# Altium schematic sheet 15_BTB_Connector_P101-P200.SchDoc: Board to Board Connector B
size 420 x 297 mm; Author: Lukas Henkel; DocumentNumber: 15; SheetNumber: 15; SheetTotal: 16; DocSize: A3
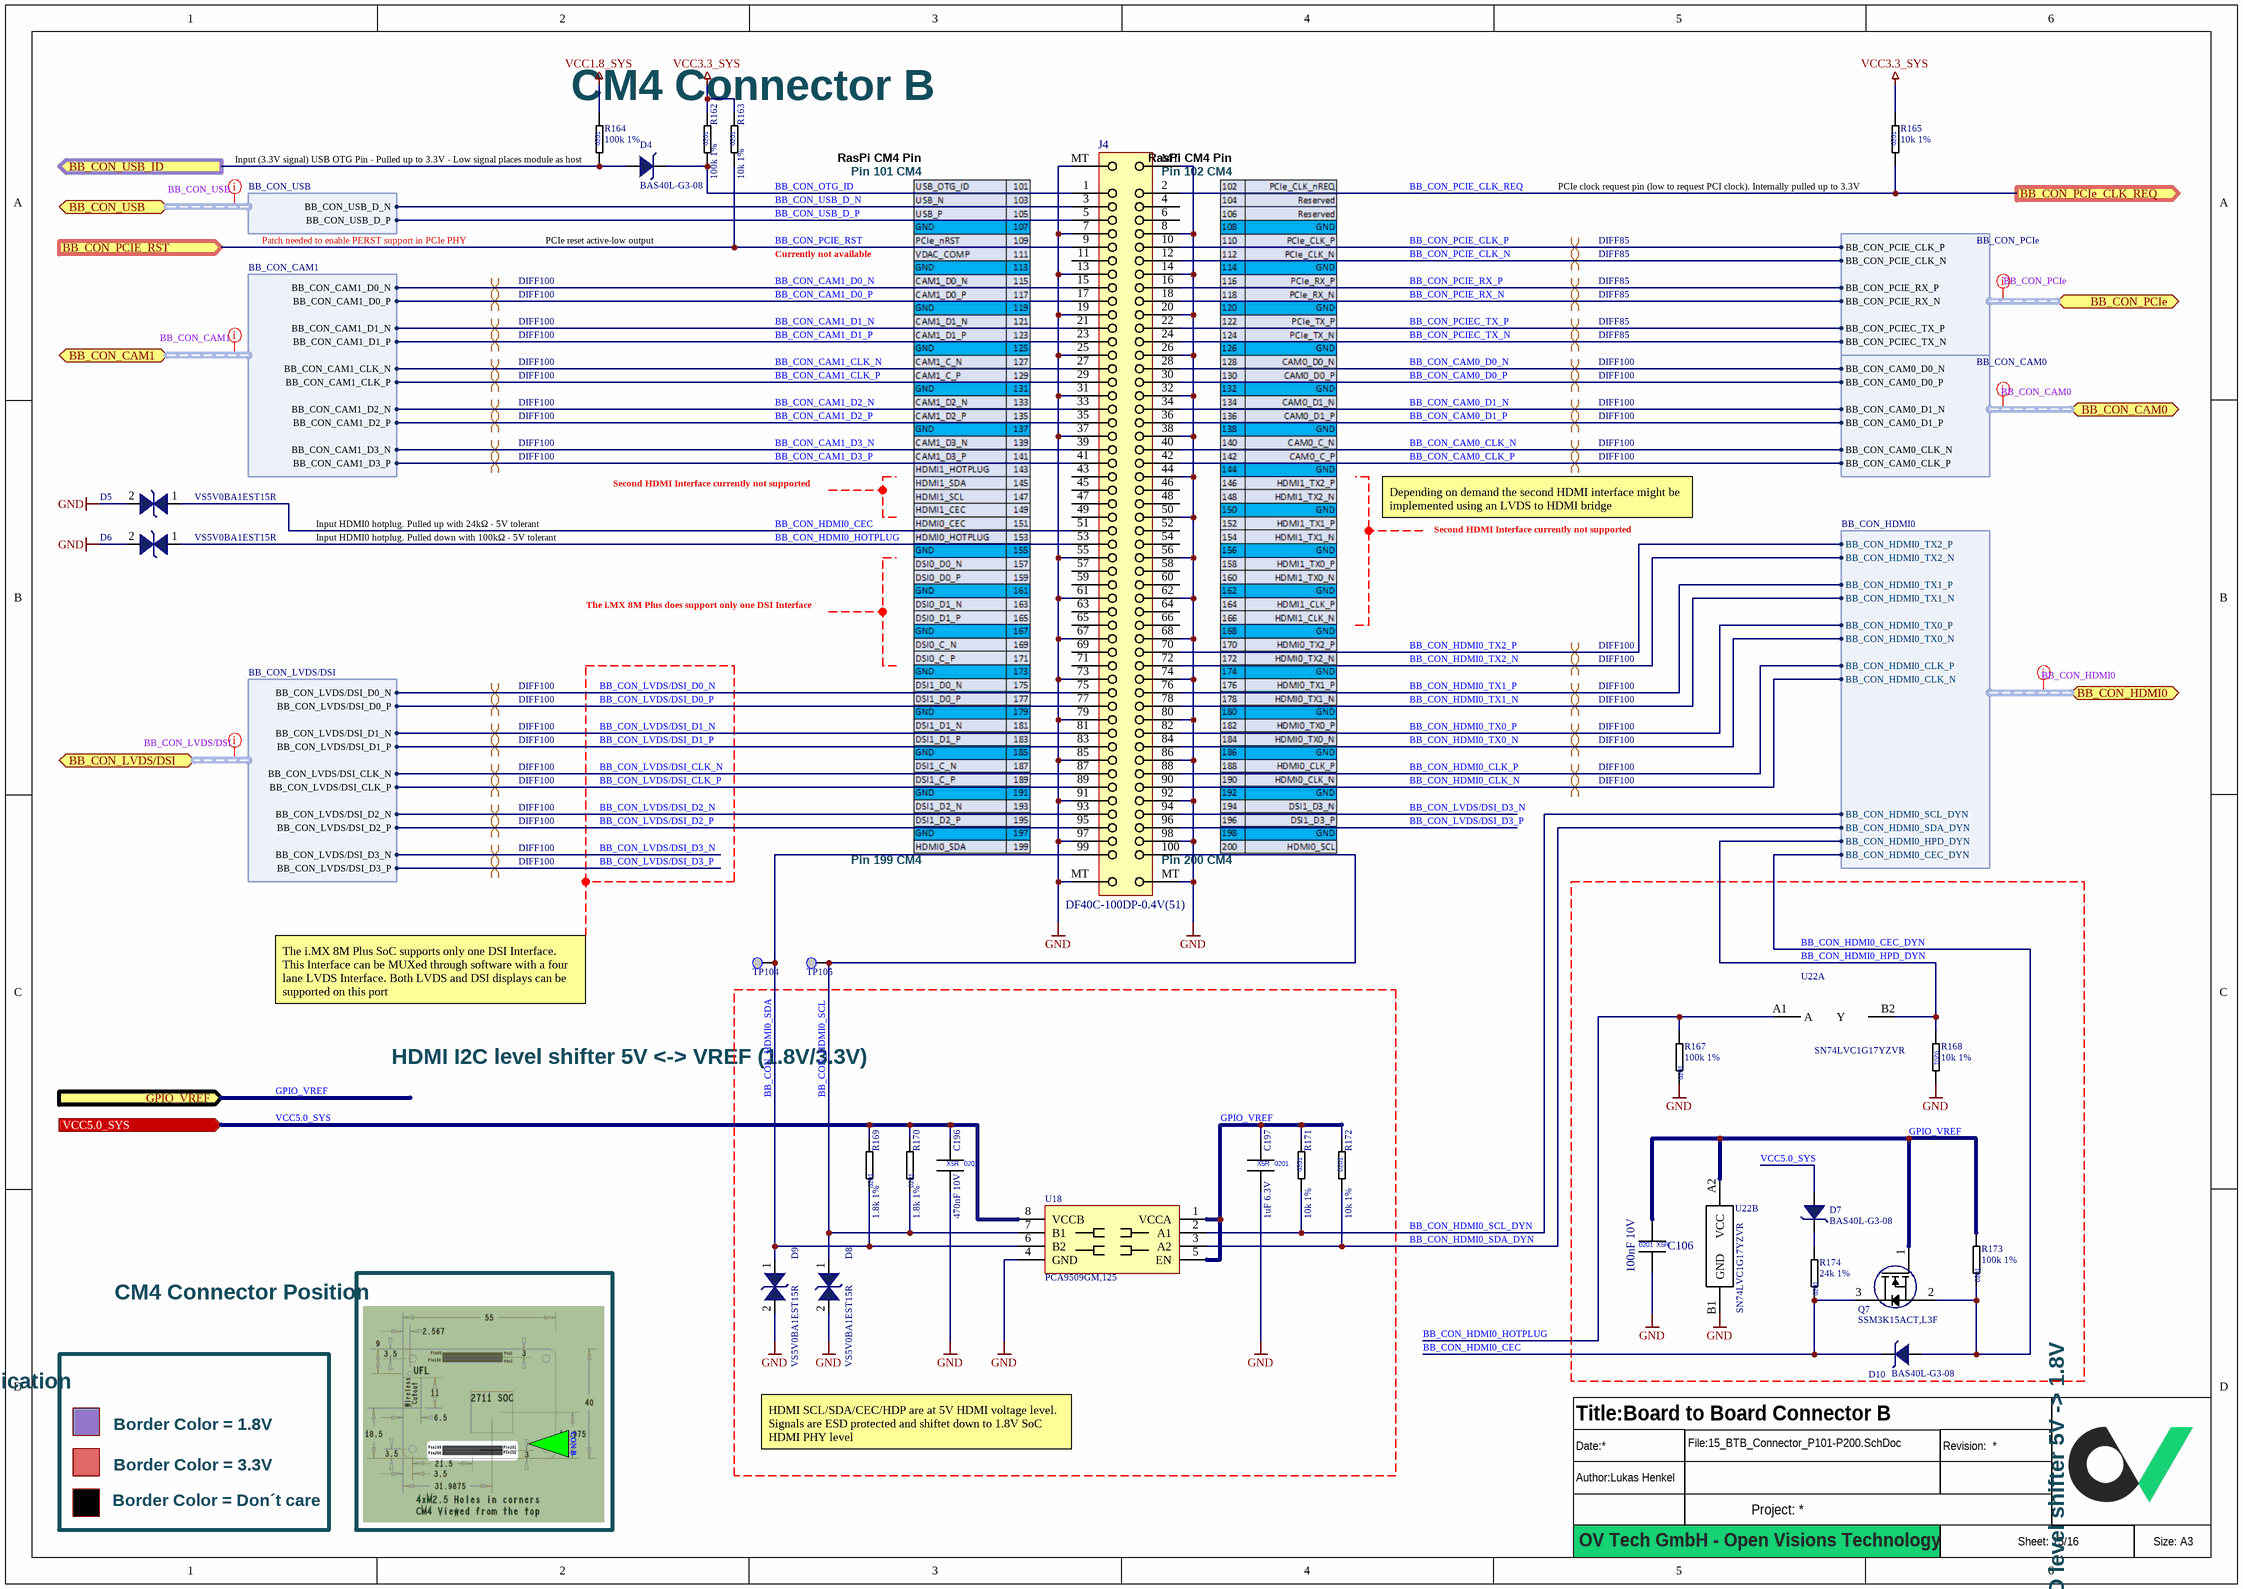
[diagram p0: 15_BTB_Connector_P101-P200.SchDoc]

## Parts
?  (no value)  (graphical)
C106  100nF 10V  [CAPC0603X03L]
C196  470nF 10V  [CAPC0603X03L]
C197  1uF 6.3V  [CAPC0603X03L]
D4  BAS40L-G3-08  [DFN1006-2A]
D5  VS5V0BA1EST15R  [DFN38P60X29-2L]
D6  VS5V0BA1EST15R  [DFN38P60X29-2L]
D7  BAS40L-G3-08  [DFN1006-2A]
D8  VS5V0BA1EST15R  [DFN38P60X29-2L]
D9  VS5V0BA1EST15R  [DFN38P60X29-2L]
D10  BAS40L-G3-08  [DFN1006-2A]
J4  DF40C-100DP-0.4V(51)  [BOARD-TO-BOARD DF40C-100DP-0.4V]
Q7  SSM3K15ACT,L3F  [DFN65P100X50-3L]
R162  100k 1%  [RESC0603X03L]
R163  10k 1%  [RESC0603X03L]
R164  100k 1%  [RESC0603X03L]
R165  10k 1%  [RESC0603X03L]
R167  100k 1%  [RESC0603X03L]
R168  10k 1%  [RESC0603X03L]
R169  1.8k 1%  [RESC0603X03L]
R170  1.8k 1%  [RESC0603X03L]
R171  10k 1%  [RESC0603X03L]
R172  10k 1%  [RESC0603X03L]
R173  100k 1%  [RESC0603X03L]
R174  24k 1%  [RESC0603X03L]
TP104  Testpoint 0.5mm  [TP_0.50mm]  (value not drawn)  (no BOM)
TP105  Testpoint 0.5mm  [TP_0.50mm]  (value not drawn)  (no BOM)
U18  PCA9509GM,125  [XQFN8_160X106X50]
U22  SN74LVC1G17YZVR  [BGA4C50P2X2_89X89X50]  (parts A,B of 2)

## Blocks framed on the sheet
HDMI CEC and HPD level shifter 5V -> 1.8V: C106 D7 D10 Q7 R167 R168 R173 R174 U22
HDMI I2C level shifter 5V <-> VREF (1.8V/3.3V): C196 C197 D8 D9 R169-R172 U18

## Ports
BB_CON_CAM0 (bidir, harness BB_CON_CAM0), BB_CON_CAM1 (bidir, harness BB_CON_CAM1), BB_CON_HDMI0 (bidir, harness BB_CON_HDMI0), BB_CON_LVDS/DSI (bidir, harness BB_CON_LVDS/DSI), BB_CON_PCIe (bidir, harness BB_CON_PCIe), BB_CON_PCIe_CLK_REQ (out), BB_CON_PCIE_RST (in), BB_CON_USB (bidir, harness BB_CON_USB), BB_CON_USB_ID (out), GPIO_VREF (in), VCC5.0_SYS (in)

## Harnesses
BB_CON_USB: BB_CON_USB_D_N, BB_CON_USB_D_P
BB_CON_PCIe: BB_CON_PCIE_CLK_N, BB_CON_PCIE_CLK_P, BB_CON_PCIEC_TX_N, BB_CON_PCIE_RX_P, BB_CON_PCIE_RX_N, BB_CON_PCIEC_TX_P
BB_CON_CAM1: BB_CON_CAM1_D0_N, BB_CON_CAM1_D0_P, BB_CON_CAM1_D1_N, BB_CON_CAM1_D1_P, BB_CON_CAM1_CLK_N, BB_CON_CAM1_CLK_P, BB_CON_CAM1_D2_N, BB_CON_CAM1_D2_P, BB_CON_CAM1_D3_N, BB_CON_CAM1_D3_P
BB_CON_CAM0: BB_CON_CAM0_D0_N, BB_CON_CAM0_D0_P, BB_CON_CAM0_D1_N, BB_CON_CAM0_D1_P, BB_CON_CAM0_CLK_N, BB_CON_CAM0_CLK_P
BB_CON_HDMI0: BB_CON_HDMI0_SCL_DYN, BB_CON_HDMI0_SDA_DYN, BB_CON_HDMI0_HPD_DYN, BB_CON_HDMI0_CEC_DYN, BB_CON_HDMI0_CLK_N, BB_CON_HDMI0_CLK_P, BB_CON_HDMI0_TX0_N, BB_CON_HDMI0_TX0_P, BB_CON_HDMI0_TX1_N, BB_CON_HDMI0_TX1_P, BB_CON_HDMI0_TX2_N, BB_CON_HDMI0_TX2_P
BB_CON_LVDS/DSI: BB_CON_LVDS/DSI_D0_P, BB_CON_LVDS/DSI_D0_N, BB_CON_LVDS/DSI_D1_P, BB_CON_LVDS/DSI_D1_N, BB_CON_LVDS/DSI_D2_P, BB_CON_LVDS/DSI_D2_N, BB_CON_LVDS/DSI_CLK_P, BB_CON_LVDS/DSI_CLK_N, BB_CON_LVDS/DSI_D3_P, BB_CON_LVDS/DSI_D3_N

## Nets
GND: C106.2 C196.2 C197.2 D5.2 D6.2 D8.2 D9.2 J4.7 J4.8 J4.13 J4.14 J4.19 J4.20 J4.25 J4.26 J4.31 J4.32 J4.37 J4.38 J4.44 J4.50 J4.55 J4.56 J4.61 J4.62 J4.67 J4.68 J4.73 J4.74 J4.79 J4.80 J4.85 J4.86 J4.91 J4.92 J4.97 J4.98 J4.MT R167.1 R168.2 U18.4(GND) U22.B1(GND)
VCC1.8_SYS: R164.2
VCC3.3_SYS: R162.2 R163.2 R165.2
BB_CON_CAM0_CLK_N: J4.40 ; port BB_CON_CAM0.BB_CON_CAM0_CLK_N
BB_CON_CAM0_CLK_P: J4.42 ; port BB_CON_CAM0.BB_CON_CAM0_CLK_P
BB_CON_CAM0_D0_N: J4.28 ; port BB_CON_CAM0.BB_CON_CAM0_D0_N
BB_CON_CAM0_D0_P: J4.30 ; port BB_CON_CAM0.BB_CON_CAM0_D0_P
BB_CON_CAM0_D1_N: J4.34 ; port BB_CON_CAM0.BB_CON_CAM0_D1_N
BB_CON_CAM0_D1_P: J4.36 ; port BB_CON_CAM0.BB_CON_CAM0_D1_P
BB_CON_CAM1_CLK_N: J4.27 ; port BB_CON_CAM1.BB_CON_CAM1_CLK_N
BB_CON_CAM1_CLK_P: J4.29 ; port BB_CON_CAM1.BB_CON_CAM1_CLK_P
BB_CON_CAM1_D0_N: J4.15 ; port BB_CON_CAM1.BB_CON_CAM1_D0_N
BB_CON_CAM1_D0_P: J4.17 ; port BB_CON_CAM1.BB_CON_CAM1_D0_P
BB_CON_CAM1_D1_N: J4.21 ; port BB_CON_CAM1.BB_CON_CAM1_D1_N
BB_CON_CAM1_D1_P: J4.23 ; port BB_CON_CAM1.BB_CON_CAM1_D1_P
BB_CON_CAM1_D2_N: J4.33 ; port BB_CON_CAM1.BB_CON_CAM1_D2_N
BB_CON_CAM1_D2_P: J4.35 ; port BB_CON_CAM1.BB_CON_CAM1_D2_P
BB_CON_CAM1_D3_N: J4.39 ; port BB_CON_CAM1.BB_CON_CAM1_D3_N
BB_CON_CAM1_D3_P: J4.41 ; port BB_CON_CAM1.BB_CON_CAM1_D3_P
BB_CON_HDMI0_CEC: D5.1 D10.1 J4.51 Q7.3(D) R174.1
BB_CON_HDMI0_CEC_DYN: D10.2 Q7.2(S) R173.1 ; port BB_CON_HDMI0.BB_CON_HDMI0_CEC_DYN
BB_CON_HDMI0_CLK_N: J4.90 ; port BB_CON_HDMI0.BB_CON_HDMI0_CLK_N
BB_CON_HDMI0_CLK_P: J4.88 ; port BB_CON_HDMI0.BB_CON_HDMI0_CLK_P
BB_CON_HDMI0_HOTPLUG: D6.1 J4.53 R167.2 U22.A1(A)
BB_CON_HDMI0_HPD_DYN: R168.1 U22.B2(Y) ; port BB_CON_HDMI0.BB_CON_HDMI0_HPD_DYN
BB_CON_HDMI0_SCL: D8.1 J4.100 R170.1 TP105.TP U18.7(B1)
BB_CON_HDMI0_SCL_DYN: R171.1 U18.2(A1) ; port BB_CON_HDMI0.BB_CON_HDMI0_SCL_DYN
BB_CON_HDMI0_SDA: D9.1 J4.99 R169.1 TP104.TP U18.6(B2)
BB_CON_HDMI0_SDA_DYN: R172.1 U18.3(A2) ; port BB_CON_HDMI0.BB_CON_HDMI0_SDA_DYN
BB_CON_HDMI0_TX0_N: J4.84 ; port BB_CON_HDMI0.BB_CON_HDMI0_TX0_N
BB_CON_HDMI0_TX0_P: J4.82 ; port BB_CON_HDMI0.BB_CON_HDMI0_TX0_P
BB_CON_HDMI0_TX1_N: J4.78 ; port BB_CON_HDMI0.BB_CON_HDMI0_TX1_N
BB_CON_HDMI0_TX1_P: J4.76 ; port BB_CON_HDMI0.BB_CON_HDMI0_TX1_P
BB_CON_HDMI0_TX2_N: J4.72 ; port BB_CON_HDMI0.BB_CON_HDMI0_TX2_N
BB_CON_HDMI0_TX2_P: J4.70 ; port BB_CON_HDMI0.BB_CON_HDMI0_TX2_P
BB_CON_LVDS/DSI_CLK_N: J4.87 ; port BB_CON_LVDS/DSI.BB_CON_LVDS/DSI_CLK_N
BB_CON_LVDS/DSI_CLK_P: J4.89 ; port BB_CON_LVDS/DSI.BB_CON_LVDS/DSI_CLK_P
BB_CON_LVDS/DSI_D0_N: J4.75 ; port BB_CON_LVDS/DSI.BB_CON_LVDS/DSI_D0_N
BB_CON_LVDS/DSI_D0_P: J4.77 ; port BB_CON_LVDS/DSI.BB_CON_LVDS/DSI_D0_P
BB_CON_LVDS/DSI_D1_N: J4.81 ; port BB_CON_LVDS/DSI.BB_CON_LVDS/DSI_D1_N
BB_CON_LVDS/DSI_D1_P: J4.83 ; port BB_CON_LVDS/DSI.BB_CON_LVDS/DSI_D1_P
BB_CON_LVDS/DSI_D2_N: J4.93 ; port BB_CON_LVDS/DSI.BB_CON_LVDS/DSI_D2_N
BB_CON_LVDS/DSI_D2_P: J4.95 ; port BB_CON_LVDS/DSI.BB_CON_LVDS/DSI_D2_P
BB_CON_LVDS/DSI_D3_N: J4.94 ; port BB_CON_LVDS/DSI.BB_CON_LVDS/DSI_D3_N
BB_CON_LVDS/DSI_D3_P: J4.96 ; port BB_CON_LVDS/DSI.BB_CON_LVDS/DSI_D3_P
BB_CON_OTG_ID: D4.1 J4.1 R162.1
BB_CON_PCIE_CLK_N: J4.12 ; port BB_CON_PCIe.BB_CON_PCIE_CLK_N
BB_CON_PCIE_CLK_P: J4.10 ; port BB_CON_PCIe.BB_CON_PCIE_CLK_P
BB_CON_PCIE_CLK_REQ: J4.2 R165.1 ; port BB_CON_PCIe_CLK_REQ
BB_CON_PCIE_RST: J4.9 R163.1 ; port BB_CON_PCIE_RST
BB_CON_PCIE_RX_N: J4.18 ; port BB_CON_PCIe.BB_CON_PCIE_RX_N
BB_CON_PCIE_RX_P: J4.16 ; port BB_CON_PCIe.BB_CON_PCIE_RX_P
BB_CON_PCIEC_TX_N: J4.24 ; port BB_CON_PCIe.BB_CON_PCIEC_TX_N
BB_CON_PCIEC_TX_P: J4.22 ; port BB_CON_PCIe.BB_CON_PCIEC_TX_P
BB_CON_USB_D_N: J4.3 ; port BB_CON_USB.BB_CON_USB_D_N
BB_CON_USB_D_P: J4.5 ; port BB_CON_USB.BB_CON_USB_D_P
BB_CON_USB_ID: D4.2 R164.1 ; port BB_CON_USB_ID
GPIO_VREF: C106.1 C197.1 Q7.1(G) R171.2 R172.2 R173.2 U18.1(VCCA) U18.5(EN) U22.A2(VCC) ; port GPIO_VREF
VCC5.0_SYS: C196.1 D7.2 R169.2 R170.2 U18.8(VCCB) ; port VCC5.0_SYS
NetD7_1: D7.1 R174.2

Not connected (* = marked no-connect by the designer): J4 4 6 11 43 45 46 47 48 49 52 54 57 58 59 60 63 64 65 66 69 71

## Layout directives
net class BB_CON_USB: (no net found under the mark)
net class BB_CON_PCIe: (no net found under the mark)
net class BB_CON_CAM1: (no net found under the mark)
net class BB_CON_CAM0: (no net found under the mark)
net class BB_CON_HDMI0: (no net found under the mark)
net class BB_CON_LVDS/DSI: (no net found under the mark)
differential pair; differential pair class DIFF85: BB_CON_PCIE_CLK_N, BB_CON_PCIE_CLK_P, BB_CON_PCIE_RX_N, BB_CON_PCIE_RX_P, BB_CON_PCIEC_TX_N, BB_CON_PCIEC_TX_P
differential pair; differential pair class DIFF100: BB_CON_CAM0_CLK_N, BB_CON_CAM0_CLK_P, BB_CON_CAM0_D0_N, BB_CON_CAM0_D0_P, BB_CON_CAM0_D1_N, BB_CON_CAM0_D1_P, BB_CON_CAM1_CLK_N, BB_CON_CAM1_CLK_P, BB_CON_CAM1_D0_N, BB_CON_CAM1_D0_P, BB_CON_CAM1_D1_N, BB_CON_CAM1_D1_P, BB_CON_CAM1_D2_N, BB_CON_CAM1_D2_P, BB_CON_CAM1_D3_N, BB_CON_CAM1_D3_P, BB_CON_HDMI0_CLK_N, BB_CON_HDMI0_CLK_P, BB_CON_HDMI0_TX0_N, BB_CON_HDMI0_TX0_P, BB_CON_HDMI0_TX1_N, BB_CON_HDMI0_TX1_P, BB_CON_HDMI0_TX2_N, BB_CON_HDMI0_TX2_P, BB_CON_LVDS/DSI_CLK_N, BB_CON_LVDS/DSI_CLK_P, BB_CON_LVDS/DSI_D0_N, BB_CON_LVDS/DSI_D0_P, BB_CON_LVDS/DSI_D1_N, BB_CON_LVDS/DSI_D1_P, BB_CON_LVDS/DSI_D2_N, BB_CON_LVDS/DSI_D2_P, BB_CON_LVDS/DSI_D3_N, BB_CON_LVDS/DSI_D3_P

## Notes on the sheet
- CM4 Connector B
- Input (3.3V signal) USB OTG Pin - Pulled up to 3.3V - Low signal places module as host
- RasPi CM4 Pin
- Pin 101 CM4
- Pin 102 CM4
- (near R165) PCIe clock request pin (low to request PCI clock). Internally pulled up to 3.3V
- Patch needed to enable PERST support in PCIe PHY
- PCIe reset active-low output
- Currently not available
- Input HDMI0 hotplug. Pulled up with 24kΩ - 5V tolerant
- Second HDMI Interface currently not supported
- Depending on demand the second HDMI interface might be implemented using an LVDS to HDMI bridge
- Input HDMI0 hotplug. Pulled down with 100kΩ - 5V tolerant
- The i.MX 8M Plus does support only one DSI Interface
- Pin 199 CM4
- Pin 200 CM4
- The i.MX 8M Plus SoC supports only one DSI Interface. This Interface can be MUXed through software with a four lane LVDS Interface. Both LVDS and DSI displays can be supported on this port
- CM4 Connector Position
- Signal Level Indication
- Border Color = 1.8V
- Border Color = 3.3V
- CON B
- HDMI SCL/SDA/CEC/HDP are at 5V HDMI voltage level.
  Signals are ESD protected and shiftet down to 1.8V SoC HDMI PHY level
- Border Color = Don´t care
- OV Tech GmbH - Open Visions Technology
- (in symbol CAP_0201_1uF_6.3V) X5R; 0201
- (in symbol CAP_0201_100nF_10V) 0201; X5R
- (in symbol CAP_0201_470nF_10V) X5R; 0201
- (in symbol RES_0201_1.8k_1%) 0201
- (in symbol RES_0201_10k_1%) 0201
- (in symbol RES_0201_24k_1%) 0201
- (in symbol RES_0201_100k_1%) 0201

## Library data of the parts
? = Titleblock_01_OpenSource
C106 = CAP_0201_100nF_10V: Multilayer Ceramic Capacitors MLCC - SMD/SMT 0201 10VDC; Manufacturer 1: Murata Electronics; Manufacturer 1 Prt. Nr.: GRT033R61A104KE01J; Manufacturer 2 Prt. Nr.: CL03A104MP3NNNC; Manufacturer 2: Samsung Electro-Mechanics
C196 = CAP_0201_470nF_10V: Multilayer Ceramic Capacitors MLCC - SMD/SMT 0201 10VDC; Manufacturer 1: Taiyo Yuden; Manufacturer 1 Prt. Nr.: LMK063BBJ474KPLF; Manufacturer 2 Prt. Nr.: C0603X5R1A474M030BC; Manufacturer 2: TDK
C197 = CAP_0201_1uF_6.3V: Multilayer Ceramic Capacitors MLCC - SMD/SMT 0201 6.3VDC; Manufacturer 1: Murata Electronics; Manufacturer 1 Prt. Nr.: GRM033R60J105MEA2D; Manufacturer 2 Prt. Nr.: CL03A105MQ3CSNC; Manufacturer 2: Samsung Electro-Mechanics
D4 D7 D10 = Schottky 40V_200mA_BAS40L-G3-08: Schottky Diodes & Rectifiers; Manufacturer 1: Vishay; Manufacturer 1 Prt. Nr.: BAS40L-G3-08
D5 D6 D8 D9 = ESD Protection Diode_5V_VS5V0BA1EST15R: ESD Diode Suppressors Bidirectional 5V working voltage 0201; Manufacturer 1: ROHM Semiconductor; Manufacturer 1 Prt. Nr.: VS5V0BA1EST15R
J4 = Board to Board Connector_DF40C-100DP-0.4V(51): Board to Board connector 100Pol Stacking Header 0.4mm Pitch; Manufacturer 1: Hirose Connector; Manufacturer 1 Prt. Nr.: DF40C-100DP-0.4V(51)
Q7 = N-Channel MOSFET_SSM3K15ACT,L3F: MOSFET 30V SGL N-CH TRENCHMOS Logic Level; Manufacturer 1: Toshiba; Manufacturer 1 Prt. Nr.: SSM3K15ACT,L3F
R162 R164 R167 R173 = RES_0201_100k_1%: Thick Film Resistors - SMD 100K OHM 1%; Manufacturer 1: Yageo; Manufacturer 1 Prt. Nr.: RC0201FR-07100KL; Manufacturer 2 Prt. Nr.: CRCW0201100KFNED; Manufacturer 2: Vishay / Dale
R163 R165 R168 R171 R172 = RES_0201_10k_1%: Thick Film Resistors - SMD 10K OHM 1%; Manufacturer 1: Yageo; Manufacturer 1 Prt. Nr.: RC0201FR-0710KL; Manufacturer 2 Prt. Nr.: CRCW020110K0FNED; Manufacturer 2: Vishay / Dale
R169 R170 = RES_0201_1.8k_1%: Thick Film Resistors - SMD 1.8K OHM 1%; Manufacturer 1: Panasonic; Manufacturer 1 Prt. Nr.: ERJ-1GNF1801C; Manufacturer 2 Prt. Nr.: CRCW02011K80FKED; Manufacturer 2: Vishay / Dale
R174 = RES_0201_24k_1%: Thick Film Resistors - SMD 24K OHM 1%; Manufacturer 1: Yageo; Manufacturer 1 Prt. Nr.: RC0201FR-0724KL; Manufacturer 2 Prt. Nr.: CRCW020124K0FKED; Manufacturer 2: Vishay / Dale
U18 = I2C_Bidirectional_LvL Shift_PCA9509GM: Level SHifter Dual Channel Bidirectional for I2C up to 400kHz; Manufacturer 1: NXP Semiconductors; Manufacturer 1 Prt. Nr.: PCA9509GM,125
U22 = Buffer_SN74LVC1G17YZVR: Single Buffer SN74LVC1G17DPWR; Manufacturer 1: Texas Instruments; Manufacturer 1 Prt. Nr.: SN74LVC1G17YZVR